# Altium schematic sheet V1_PWM-to-analog_sch.SchDoc
size A4; SheetNumber: 5; SheetTotal: 5
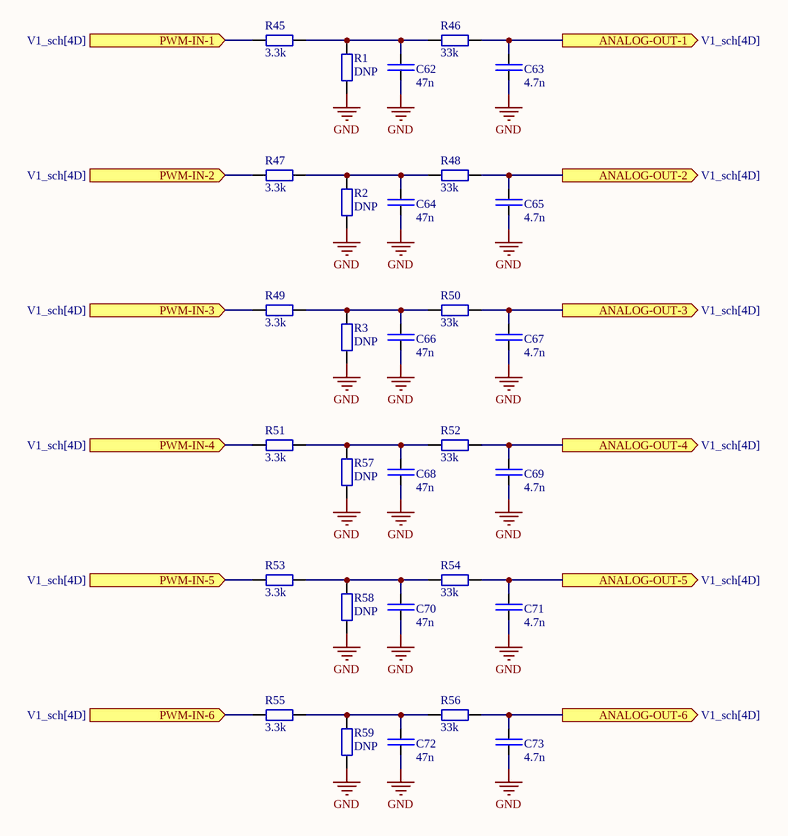
[diagram p0: V1_PWM-to-analog_sch.SchDoc]

## Parts
C62  value 47n  [FPR_0603_C_R0]  (hidden comment: PN_C0603_TBD)
C63  value 4.7n  [FPR_0603_C_R0]  (hidden comment: PN_C0603_TBD)
C64  value 47n  [FPR_0603_C_R0]  (hidden comment: PN_C0603_TBD)
C65  value 4.7n  [FPR_0603_C_R0]  (hidden comment: PN_C0603_TBD)
C66  value 47n  [FPR_0603_C_R0]  (hidden comment: PN_C0603_TBD)
C67  value 4.7n  [FPR_0603_C_R0]  (hidden comment: PN_C0603_TBD)
C68  value 47n  [FPR_0603_C_R0]  (hidden comment: PN_C0603_TBD)
C69  value 4.7n  [FPR_0603_C_R0]  (hidden comment: PN_C0603_TBD)
C70  value 47n  [FPR_0603_C_R0]  (hidden comment: PN_C0603_TBD)
C71  value 4.7n  [FPR_0603_C_R0]  (hidden comment: PN_C0603_TBD)
C72  value 47n  [FPR_0603_C_R0]  (hidden comment: PN_C0603_TBD)
C73  value 4.7n  [FPR_0603_C_R0]  (hidden comment: PN_C0603_TBD)
R1  value DNP  [FPR_0603_R_R0]  (hidden comment: PN_R0603_TBD)
R2  value DNP  [FPR_0603_R_R0]  (hidden comment: PN_R0603_TBD)
R3  value DNP  [FPR_0603_R_R0]  (hidden comment: PN_R0603_TBD)
R45  value 3.3k  [FPR_0603_R_R0]  (hidden comment: PN_R0603_TBD)
R46  value 33k  [FPR_0603_R_R0]  (hidden comment: PN_R0603_TBD)
R47  value 3.3k  [FPR_0603_R_R0]  (hidden comment: PN_R0603_TBD)
R48  value 33k  [FPR_0603_R_R0]  (hidden comment: PN_R0603_TBD)
R49  value 3.3k  [FPR_0603_R_R0]  (hidden comment: PN_R0603_TBD)
R50  value 33k  [FPR_0603_R_R0]  (hidden comment: PN_R0603_TBD)
R51  value 3.3k  [FPR_0603_R_R0]  (hidden comment: PN_R0603_TBD)
R52  value 33k  [FPR_0603_R_R0]  (hidden comment: PN_R0603_TBD)
R53  value 3.3k  [FPR_0603_R_R0]  (hidden comment: PN_R0603_TBD)
R54  value 33k  [FPR_0603_R_R0]  (hidden comment: PN_R0603_TBD)
R55  value 3.3k  [FPR_0603_R_R0]  (hidden comment: PN_R0603_TBD)
R56  value 33k  [FPR_0603_R_R0]  (hidden comment: PN_R0603_TBD)
R57  value DNP  [FPR_0603_R_R0]  (hidden comment: PN_R0603_TBD)
R58  value DNP  [FPR_0603_R_R0]  (hidden comment: PN_R0603_TBD)
R59  value DNP  [FPR_0603_R_R0]  (hidden comment: PN_R0603_TBD)

## Ports
ANALOG-OUT-1 (out, see V1_sch[4D]), ANALOG-OUT-2 (out, see V1_sch[4D]), ANALOG-OUT-3 (out, see V1_sch[4D]), ANALOG-OUT-4 (out, see V1_sch[4D]), ANALOG-OUT-5 (out, see V1_sch[4D]), ANALOG-OUT-6 (out, see V1_sch[4D]), PWM-IN-1 (in, see V1_sch[4D]), PWM-IN-2 (in, see V1_sch[4D]), PWM-IN-3 (in, see V1_sch[4D]), PWM-IN-4 (in, see V1_sch[4D]), PWM-IN-5 (in, see V1_sch[4D]), PWM-IN-6 (in, see V1_sch[4D])

## Nets
GND: C62.1 C63.1 C64.1 C65.1 C66.1 C67.1 C68.1 C69.1 C70.1 C71.1 C72.1 C73.1 R1.2 R2.2 R3.2 R57.2 R58.2 R59.2
ANALOG-OUT-1: C63.2 R46.1 ; port ANALOG-OUT-1
ANALOG-OUT-2: C65.2 R48.1 ; port ANALOG-OUT-2
ANALOG-OUT-3: C67.2 R50.1 ; port ANALOG-OUT-3
ANALOG-OUT-4: C69.2 R52.1 ; port ANALOG-OUT-4
ANALOG-OUT-5: C71.2 R54.1 ; port ANALOG-OUT-5
ANALOG-OUT-6: C73.2 R56.1 ; port ANALOG-OUT-6
PWM-IN-1: R45.2 ; port PWM-IN-1
PWM-IN-2: R47.2 ; port PWM-IN-2
PWM-IN-3: R49.2 ; port PWM-IN-3
PWM-IN-4: R51.2 ; port PWM-IN-4
PWM-IN-5: R53.2 ; port PWM-IN-5
PWM-IN-6: R55.2 ; port PWM-IN-6
NetC62_2: C62.2 R1.1 R45.1 R46.2
NetC64_2: C64.2 R2.1 R47.1 R48.2
NetC66_2: C66.2 R3.1 R49.1 R50.2
NetC68_2: C68.2 R51.1 R52.2 R57.1
NetC70_2: C70.2 R53.1 R54.2 R58.1
NetC72_2: C72.2 R55.1 R56.2 R59.1

## Library data of the parts
C62-C73 = C: Capacitor - generic SMD
R1-R3 R45-R59 = R: Resistor - generic SMD